# Altium schematic sheet CC2538V1.0_20131209.SchDoc
size A3
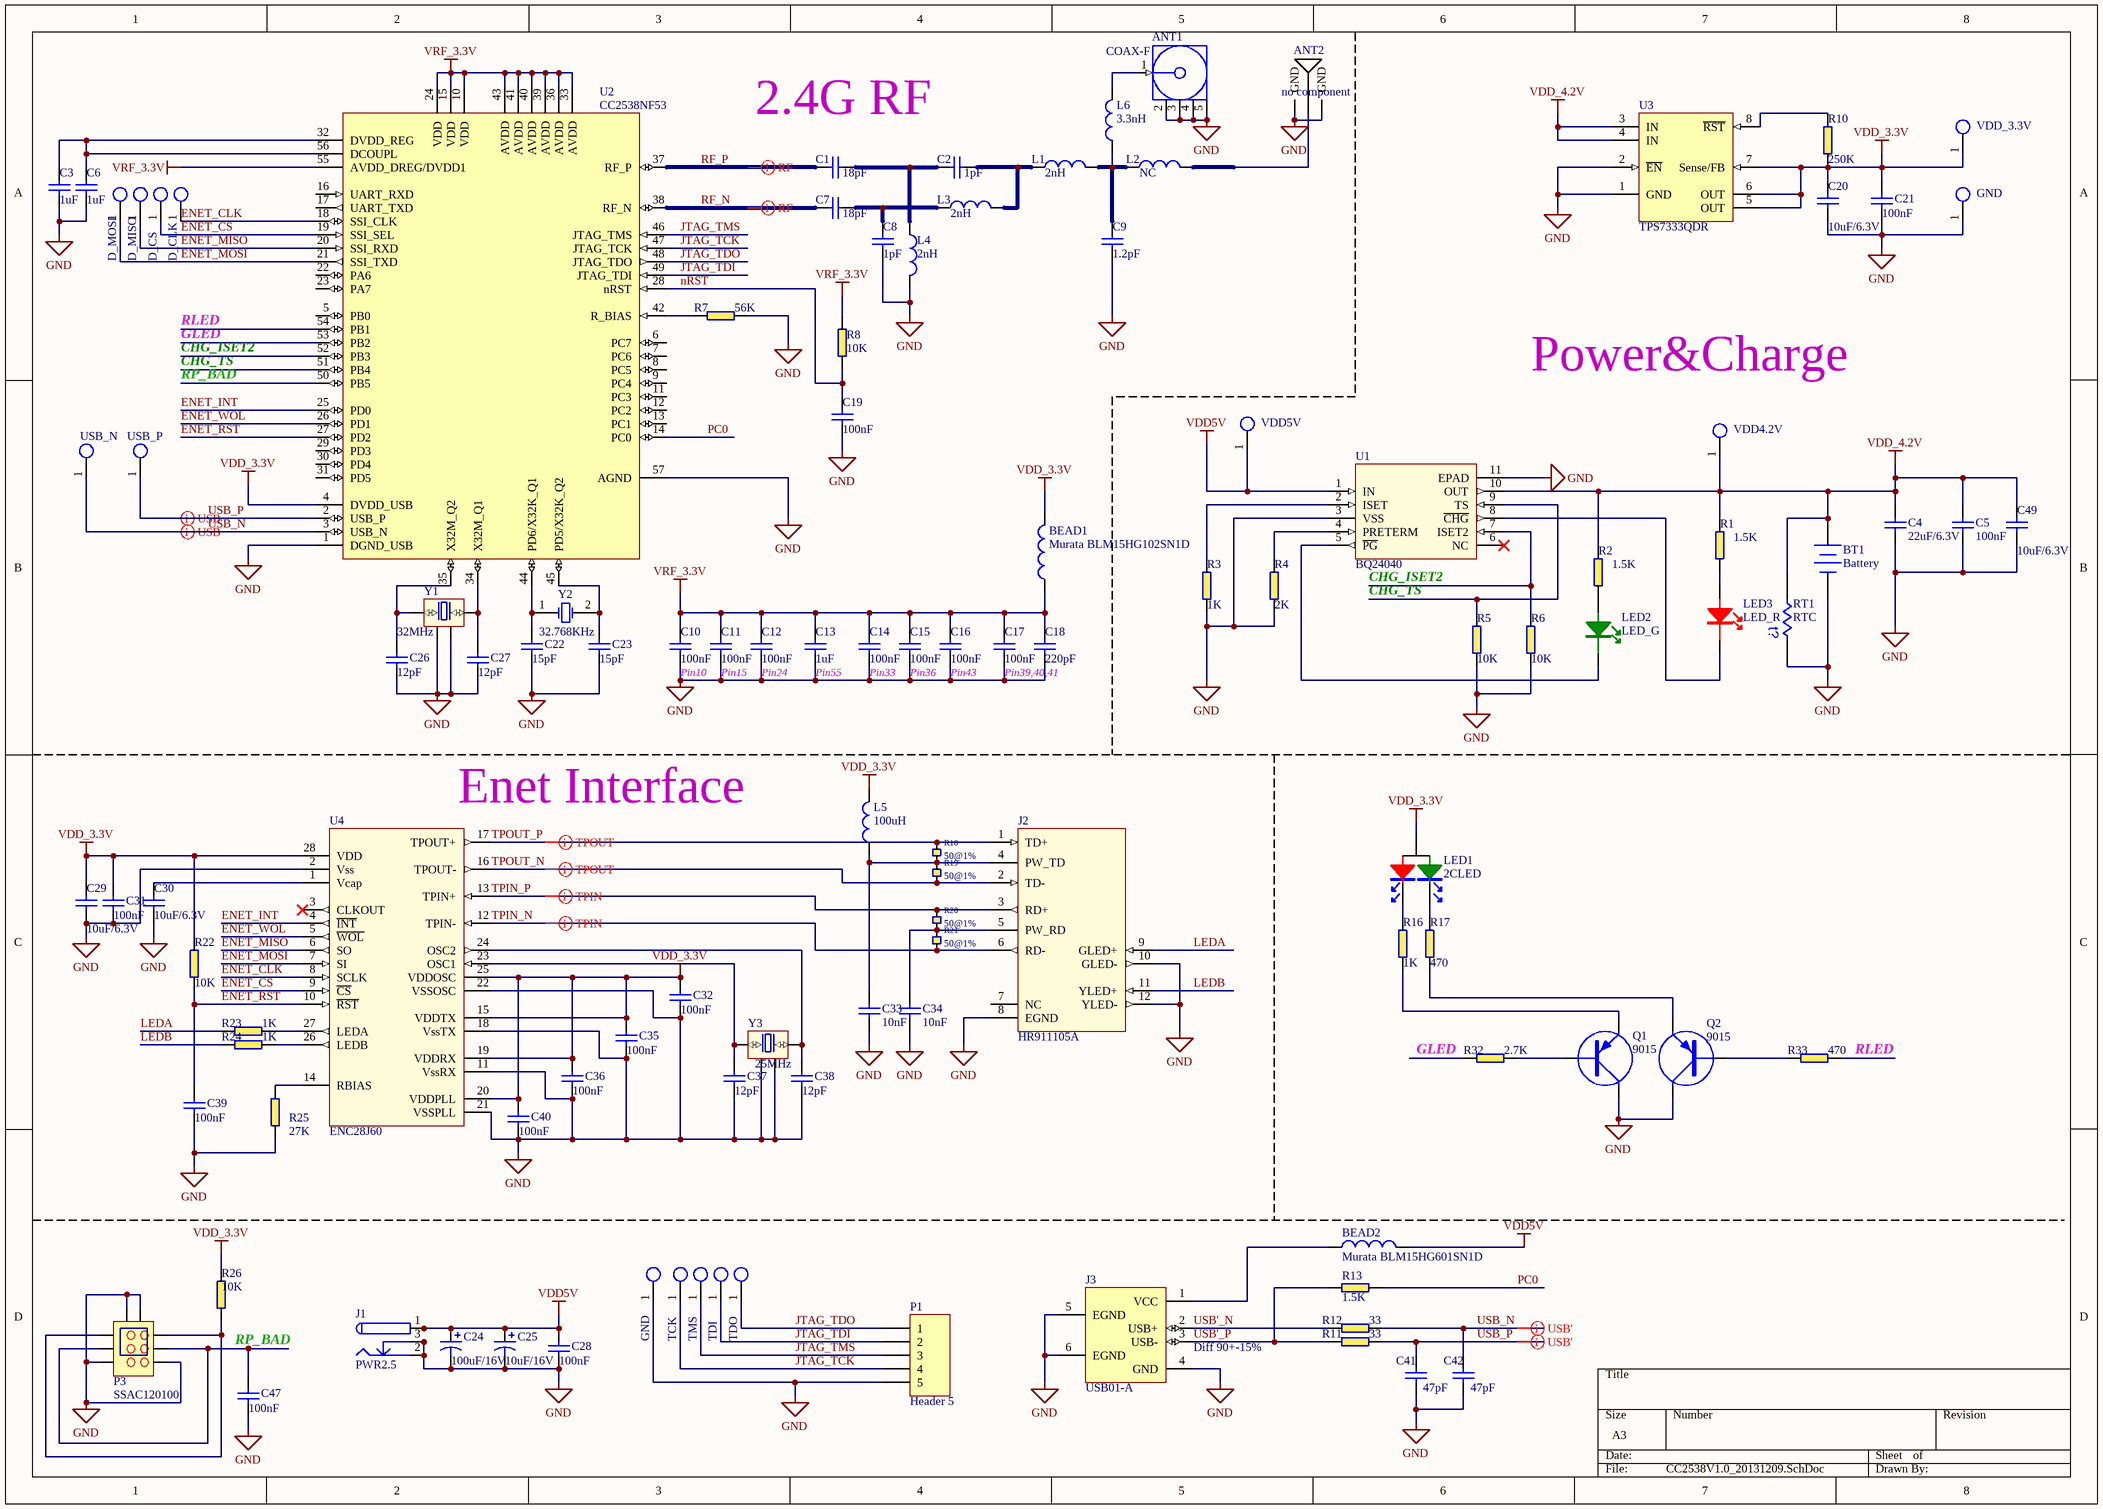
[diagram p0: CC2538V1.0_20131209.SchDoc]

## Parts
(Parts that share a designator on the sheet are numbered #1, #2 ... from top to bottom, then left to right.)
ANT1  COAX-F  [SMA-10V5-TGN-RP]
ANT2  value no component  [Inverted F Antenna]  (hidden comment: Inverted F Antenna)
BEAD1  value Murata BLM15HG102SN1D  [BEAD0402]  (hidden comment: BLM15HG102SN1D)
BEAD2  value Murata BLM15HG601SN1D  [BEAD0402]  (hidden comment: BLM15HG102SN1D)
BT1  Battery  [BAT-2]
C1  18pF  [CAP0402]
C2  1pF  [CAP0402]
C3  1uF  [CAP0402]
C4  22uF/6.3V  [CAP0805]
C5  100nF  [CAP0402]
C6  1uF  [CAP0402]
C7  18pF  [CAP0402]
C8  1pF  [CAP0402]
C9  1.2pF  [CAP0402]
C10  100nF  [CAP0402]
C11  100nF  [CAP0402]
C12  100nF  [CAP0402]
C13  1uF  [CAP0402]
C14  100nF  [CAP0402]
C15  100nF  [CAP0402]
C16  100nF  [CAP0402]
C17  100nF  [CAP0402]
C18  220pF  [CAP0402]
C19  100nF  [CAP0402]
C20  10uF/6.3V  [CAP0805]
C21  100nF  [CAP0402]
C22  value 15pF  [CAP0402]  (hidden comment: 22pF)
C23  value 15pF  [CAP0402]  (hidden comment: 22pF)
C24  100uF/16V  [6.3x5.8mm]
C25  10uF/16V  [4x5.4mm]
C26  value 12pF  [CAP0402]  (hidden comment: 10pF)
C27  12pF  [CAP0402]
C28  100nF  [CAP0402]
C29  10uF/6.3V  [CAP0805]
C30  10uF/6.3V  [CAP0805]
C31  100nF  [CAP0402]
C32  100nF  [CAP0402]
C33  10nF  [CAP0402]
C34  10nF  [CAP0402]
C35  100nF  [CAP0402]
C36  100nF  [CAP0402]
C37  value 12pF  [CAP0402]  (hidden comment: 10pF)
C38  value 12pF  [CAP0402]  (hidden comment: 10pF)
C39  100nF  [CAP0402]
C40  100nF  [CAP0402]
C41  47pF  [CAP0402]
C42  47pF  [CAP0402]
C47  100nF  [CAP0402]
C49  10uF/6.3V  [CAP0805]
D_CLK  TP  [TP_2.0]  (value not drawn)
D_CS  TP  [TP_2.0]  (value not drawn)
D_MISO  TP  [TP_2.0]  (value not drawn)
D_MOSI  TP  [TP_2.0]  (value not drawn)
GND#1  TP  [TP_2.0]  (value not drawn)
GND#2  TP  [TP_2.0]  (value not drawn)
J1  PWR2.5  [KLD-0202]
J2  HR911105A  [XFATM9DM-CT1-4M]
J3  value USB01-A  [USB_A]  (hidden comment: USB_A)
L1  2nH  [IND0402]
L2  NC  [IND0402]
L3  2nH  [IND0402]
L4  2nH  [IND0402]
L5  100uH  [IND0603]
L6  3.3nH  [IND0402]
LED1  2CLED  [2C_LED0]
LED2  LED_G  [LED]
LED3  LED_R  [LED]
P1  Header 5  [HDR1X5]
P3  SSAC120100  [SSAC120100]
Q1  9015  [QT9015]
Q2  9015  [QT9015]
R1  1.5K  [RES0402]
R2  1.5K  [RES0402]
R3  1K  [RES0402]
R4  2K  [RES0402]
R5  10K  [RES0402]
R6  10K  [RES0402]
R7  56K  [RES0402]
R8  10K  [RES0402]
R10  250K  [RES0402]
R11  33  [RES0402]
R12  33  [RES0402]
R13  1.5K  [RES0402]
R16  1K  [RES0402]
R17  470  [RES0402]
R18  50@1%  [RES0402]
R19  50@1%  [RES0402]
R20  50@1%  [RES0402]
R21  50@1%  [RES0402]
R22  10K  [RES0402]
R23  1K  [RES0402]
R24  1K  [RES0402]
R25  27K  [RES0402]
R26  10K  [RES0402]
R32  2.7K  [RES0402]
R33  470  [RES0402]
RT1  RTC  [6-0805_N]
TCK  TP  [TP_2.0]  (value not drawn)
TDI  TP  [TP_2.0]  (value not drawn)
TDO  TP  [TP_2.0]  (value not drawn)
TMS  TP  [TP_2.0]  (value not drawn)
U1  BQ24040  [DSQ10_P9X1P5]
U2  CC2538NF53  [RTQ56_6P7X6P7]
U3  TPS7333QDR  [D8]
U4  value ENC28J60  [SSOP28_MC]  (hidden comment: ENC28J60T-C/SS)
USB_N  TP  [TP_2.0]  (value not drawn)
USB_P  TP  [TP_2.0]  (value not drawn)
VDD4.2V  TP  [TP_2.0]  (value not drawn)
VDD5V  TP  [TP_2.0]  (value not drawn)
VDD_3.3V  TP  [TP_2.0]  (value not drawn)
Y1  32MHz  [SMD3225G]
Y2  32.768KHz  [3215]
Y3  25MHz  [SMD3225G]

## Nets
GND: ANT1.2(GND) ANT1.3(GND) ANT1.4(GND) ANT1.5(GND) ANT2.2(GND) ANT2.3(GND) BT1.2(-) C3.1 C4.2 C5.2 C6.1 C8.1 C9.1 C10.1 C11.1 C12.1 C13.1 C14.1 C15.1 C16.1 C17.1 C18.1 C19.1 C20.1 C21.1 C22.1 C23.1 C24.2 C25.2 C26.1 C27.1 C28.1 C29.1 C30.1 C31.1 C32.1 C33.2 C34.2 C35.1 C36.1 C37.1 C38.1 C39.1 C40.1 C41.2 C42.2 C47.1 C49.1 GND#1.1 GND#2.1 J1.2 J1.2A J1.2B J1.3 J1.3A J1.3B J2.8(EGND) J2.10(GLED-) J2.12(YLED-) J3.4(GND) J3.5(EGND) J3.6(EGND) L4.1 P1.5 P3.3 P3.4 P3.7 P3.8 Q1.C Q2.C R3.2 R4.2 R5.2 R6.2 R7.1 R25.2 RT1.1 U1.3(VSS) U1.11(EPAD) U2.1(DGND_USB) U2.57(AGND) U3.1(GND) U3.2(~{EN}) U4.2(Vss) U4.11(VssRX) U4.18(VssTX) U4.21(VSSPLL) U4.22(VSSOSC) Y1.2(GND) Y1.4(GND) Y3.2(GND) Y3.4(GND)
VDD5V: BEAD2.1 C24.1 C25.1 C28.2 J1.1 J1.1A J1.1B U1.1(IN) VDD5V.1
VDD_3.3V: BEAD1.1 C20.2 C21.2 C29.2 C31.2 C32.2 C35.2 C36.2 C40.2 L5.2 LED1.D R10.2 R22.1 R26.1 U2.4(DVDD_USB) U3.5(OUT) U3.6(OUT) U3.7(Sense/FB) U4.15(VDDTX) U4.19(VDDRX) U4.20(VDDPLL) U4.25(VDDOSC) U4.28(VDD) VDD_3.3V.1
VDD_4.2V: BT1.1(+) C4.1 C5.1 C49.2 R1.1 R2.1 RT1.2 U1.10(OUT) U3.3(IN) U3.4(IN) VDD4.2V.1
VRF_3.3V: BEAD1.2 C10.2 C11.2 C12.2 C13.2 C14.2 C15.2 C16.2 C17.2 C18.2 R8.1 U2.10(VDD) U2.15(VDD) U2.24(VDD) U2.33(AVDD) U2.36(AVDD) U2.39(AVDD) U2.40(AVDD) U2.41(AVDD) U2.43(AVDD) U2.55(AVDD_DREG/DVDD1)
CHG_ISET2: R6.1 U1.7(ISET2) U2.52(PB3)
CHG_TS: R5.1 U1.9(TS) U2.51(PB4)
ENET_CLK: D_CLK.1 U2.18(SSI_CLK) U4.8(SCLK)
ENET_CS: D_CS.1 U2.19(SSI_SEL) U4.9(~{CS})
ENET_INT: U2.25(PD0) U4.4(~{INT})
ENET_MISO: D_MISO.1 U2.20(SSI_RXD) U4.6(SO)
ENET_MOSI: D_MOSI.1 U2.21(SSI_TXD) U4.7(SI)
ENET_RST: C39.2 R22.2 U2.27(PD2) U4.10(~{RST})
ENET_WOL: U2.26(PD1) U4.5(~{WOL})
GLED: R32.2 U2.53(PB2)
JTAG_TCK: P1.4 TCK.1 U2.47(JTAG_TCK)
JTAG_TDI: P1.2 TDI.1 U2.49(JTAG_TDI)
JTAG_TDO: P1.1 TDO.1 U2.48(JTAG_TDO)
JTAG_TMS: P1.3 TMS.1 U2.46(JTAG_TMS)
LEDA: J2.9(GLED+) R23.2
LEDB: J2.11(YLED+) R24.2
nRST: C19.2 R8.2 U2.28(nRST)
PC0: R13.2 U2.14(PC0)
RF_N: C7.2 U2.38(RF_N)
RF_P: C1.2 U2.37(RF_P)
RLED: R33.1 U2.54(PB1)
RP_BAD: C47.2 P3.2 P3.5 U2.50(PB5)
TPIN_N: J2.6(RD-) R21.2 U4.12(TPIN-)
TPIN_P: J2.3(RD+) R20.1 U4.13(TPIN+)
TPOUT_N: J2.2(TD-) R19.2 U4.16(TPOUT-)
TPOUT_P: J2.1(TD+) R18.1 U4.17(TPOUT+)
USB'_N: J3.2(USB+) R12.2
USB'_P: J3.3(USB-) R11.2 R13.1
USB_N: C42.1 R12.1 U2.3(USB_N) USB_N.1
USB_P: C41.1 R11.1 U2.2(USB_P) USB_P.1
NetANT1_1: ANT1.1(Signal) L6.1
NetANT2_1: ANT2.1(ANT) L2.1
NetBEAD2_2: BEAD2.2 J3.1(VCC)
NetC1_1: C1.1 C2.2 L4.2
NetC2_1: C2.1 L1.2 L3.1
NetC3_2: C3.2 C6.2 U2.32(DVDD_REG) U2.56(DCOUPL)
NetC7_1: C7.1 C8.2 L3.2
NetC9_2: C9.2 L1.1 L2.2 L6.2
NetC22_2: C22.2 U2.44(PD6/X32K_Q1) Y2.1(OSC1)
NetC23_2: C23.2 U2.45(PD5/X32K_Q2) Y2.2(OSC2)
NetC26_2: C26.2 U2.35(X32M_Q2) Y1.1(HOT2)
NetC27_2: C27.2 U2.34(X32M_Q1) Y1.3(HOT1)
NetC30_2: C30.2 U4.1(Vcap)
NetC33_1: C33.1 J2.4(PW_TD) L5.1 R18.2 R19.1
NetC34_1: C34.1 J2.5(PW_RD) R20.2 R21.1
NetC37_2: C37.2 U4.23(OSC1) Y3.1(HOT2)
NetC38_2: C38.2 U4.24(OSC2) Y3.3(HOT1)
NetLED1_G: LED1.G R17.1
NetLED1_R: LED1.R R16.1
NetLED2_A: LED2.A R2.2
NetLED2_K: LED2.K U1.5(~{PG})
NetLED3_A: LED3.A R1.2
NetLED3_K: LED3.K U1.8(~{CHG})
NetP3_1: P3.1 P3.6 R26.2
NetQ1_B: Q1.B R32.1
NetQ1_E: Q1.E R16.2
NetQ2_B: Q2.B R33.2
NetQ2_E: Q2.E R17.2
NetR3_1: R3.1 U1.2(ISET)
NetR4_1: R4.1 U1.4(PRETERM)
NetR7_2: R7.2 U2.42(R_BIAS)
NetR10_1: R10.1 U3.8(~{RST})
NetR23_1: R23.1 U4.27(LEDA)
NetR24_1: R24.1 U4.26(LEDB)
NetR25_1: R25.1 U4.14(RBIAS)

Not connected (* = marked no-connect by the designer): J2 7(NC); U1 6(NC)*; U2 5(PB0) 6(PC7) 7(PC6) 8(PC5) 9(PC4) 11(PC3) 12(PC2) 13(PC1) 16(UART_RXD) 17(UART_TXD) 22(PA6) 23(PA7) 29(PD3) 30(PD4) 31(PD5); U4 3(CLKOUT)*

## Layout directives
differential pair: RF_N, RF_P, TPIN_N, TPIN_P, TPOUT_N, TPOUT_P, USB_N, USB_P

## Notes on the sheet
- 2.4G RF
- Power&Charge
- Pin10
- Pin15
- (near C12) Pin24
- (near C13) Pin55
- Pin33
- Pin36
- (near C16) Pin43
- Pin39,40,41
- (near U4) Enet Interface
- (near J3) Diff 90+-15%
- (in symbol Res Thermal) t?

## Library data of the parts
ANT1 = COAX-F: RF Coaxial PCB Connector, MCX; Thru-Hole, Right-Angle Mount Socket, Blunt Post Terminal, 50 Ohm Impedance; PCB_Layout: Complies with manufacturer's recommendation.; DrillSize: Corresponds to nominal value.; Value: SMA-10V5-TGN-RP; Company: HUS-TSAN  Group CO., LD; Company: HUS-TSAN GROUP CO.,LD; Published: 15-Jul-2004; LatestRevisionDate: 15-Jul-2004; LatestRevisionNote: Component Replaced.; DatasheetDocument: 30-May-2003; PackageDocument: 04-Jul-1999; PackageReference: 919-119J-51AX; Publisher: Altium Limited; ComponentLink1Description: Manufacturer Link; ComponentLink1URL: http://www.amphenolrf.com/
BEAD1 BEAD2 = Inductor: Code_IEC: 1005; Published: 8-Jun-2000; LatestRevisionDate: 29-May-2009; LatestRevisionNote: IPC-7351 Footprint Added.; PackageReference: 0402-A; Publisher: Altium Limited; PackageDescription: Chip Inductor; Code_JEITA: 0402
BT1 = Battery: Multicell Battery; Published: 24-Mar-1999; LatestRevisionDate: 17-Jul-2002; LatestRevisionNote: Re-released for DXP Platform.; PackageReference: BAT-2; Publisher: Altium Limited; PackageDescription: Battery; 2 Leads
C1-C23 C26-C42 C47 C49 = Cap: Capacitor; Published: 8-Jun-2000; LatestRevisionDate: 17-Jul-2002; LatestRevisionNote: Re-released for DXP Platform.; PackageReference: RAD-0.3; Publisher: Altium Limited; PackageDescription: Radial Cap, Thru-Hole; 2 Leads; 0.3 in Pin Spacing
  C1 C7: Value: 18pF
  C2 C8: Value: 1pF
  C3 C6 C13: Value: 1uF
  C4: Value: 22uF/6.3V
  C5 C10-C12 C14-C17 C19 C21 C28 C31 C32 C35 C36 C39 C40 C47: Value: 100nF
  C9: Value: 1.2pF
  C18: Value: 220pF
  C20 C29 C30 C49: Value: 10uF/6.3V
  C27: Value: 12pF
  C33 C34: Value: 10nF
C24 C25 = Cap Pol1: Polarized Capacitor (Radial); Published: 8-Jun-2000; LatestRevisionDate: 17-Jul-2002; LatestRevisionNote: Re-released for DXP Platform.; PackageReference: RB7.6-15; Publisher: Altium Limited; PackageDescription: Polarized Capacitor (Radial); 2 Leads
  C24: Value: 100uF/16V
  C25: Value: 10uF/16V
J1 = PWR2.5: Low Voltage Power Supply Connector; Published: 17-Dec-2003; DatasheetDocument: 09-May-2002; Publisher: Altium Limited; ComponentLink1Description: Manufacturer Link; ComponentLink1URL: http://domino.kycon.com/internet/Products.html; Value: PWR2.5
L1-L6 = inductor
  L1 L3 L4: Value: 2nH
  L2: Value: NC
  L5: Value: 100uH
  L6: Value: 3.3nH
P1 = Header 5: Header, 5-Pin; LatestRevisionDate: 17-Jul-2002; LatestRevisionNote: Re-released for DXP Platform.; Publisher: Altium Limited
Q1 Q2 = 9015: Value: Q9015
R1-R8 R10-R13 R16 R17 R22-R26 R32 R33 = RES
  R1 R2: Value: 1.5K
  R3 R16 R23 R24: Value: 1K
  R4: Value: 2K
  R5 R6 R8 R22 R26: Value: 10K
  R7: Value: 56K
  R10: Value: 250K
  R17 R33: Value: 470
  R25: Value: 27K
  R32: Value: 2.7K
R18-R21 = LRES: Value: 50@1%
RT1 = Res Thermal: Thermistor; Published: 24-Mar-1999; LatestRevisionDate: 29-May-2009; LatestRevisionNote: IPC-7351 Footprint Added.; PackageVersion: Mar-2003; PackageReference: 6-0805; Publisher: Altium Limited; PackageDescription: Chip Resistor 0805 Case Size; Code_IPC: RESC2012
U2 = CC2538
U3 = TPS7333: Value: TPS7333
U4 = ENC28J60
Y1 = CRY4: Value: Crystal, 32.000MHz, NX3225DA,10/15ppm, 8 pF,SMD package
Y2 = XTAL: Crystal Oscillator; value: Crystal, 32.768 kHz, 12.5pF, 20/50ppm; Published: 8-Jun-2000; LatestRevisionDate: 17-Jul-2002; LatestRevisionNote: Re-released for DXP Platform.; PackageReference: R38; Publisher: Altium Limited; PackageDescription: Crystal, Thru-Hole; 2 Leads; Body 3.1 x 8.2 mm (Dia.xH)
Y3 = CRY4: Value: Crystal, 25.000MHz, NX3225DA,10/15ppm, 8 pF,SMD package
J2 = HR911105A: Value: HR911105A
J3 = USB_A: Company: www.sh-gl.com
P3 = SSAC120100: Value: SSAC120100
U1 = BQ24040: Value: BQ24040